# Altium schematic sheet Block Diagram.SchDoc: Block diagram
size A4; Organization: Blinkinlabs, LLC; DocumentNumber: 1; SheetNumber: 1; SheetTotal: 14
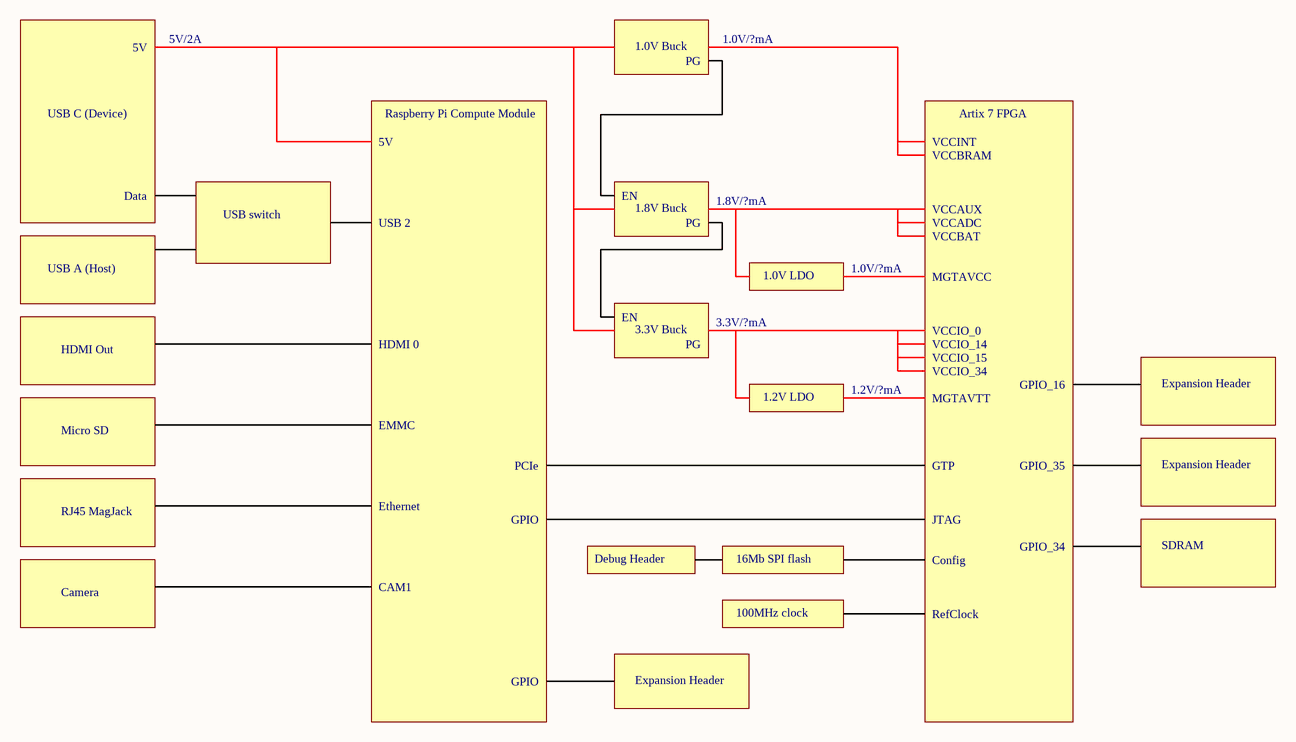
[diagram p0: Block Diagram.SchDoc]

## Notes on the sheet
- 5V
- 5V/2A
- 1.0V Buck
- PG
- 1.0V/?mA
- USB C (Device)
- Raspberry Pi Compute Module
- VCCINT
- Artix 7 FPGA
- Data
- EN
- 1.8V Buck
- 1.8V/?mA
- VCCAUX
- VCCBRAM
- USB A (Host)
- USB switch
- USB 2
- VCCADC
- VCCBAT
- MGTAVCC
- HDMI 0
- 3.3V Buck
- 3.3V/?mA
- 1.0V LDO
- VCCIO_0
- VCCIO_14
- HDMI Out
- 1.2V LDO
- 1.2V/?mA
- MGTAVTT
- VCCIO_15
- VCCIO_34
- GPIO_16
- Expansion Header
- Micro SD
- EMMC
- PCIe
- GTP
- GPIO_35
- RJ45 MagJack
- Ethernet
- GPIO
- JTAG
- GPIO_34
- Camera
- CAM1
- Debug Header
- 100MHz clock
- 16Mb SPI flash
- RefClock
- Config
- SDRAM
- Title:
- Project:
- Revision:
- Date:
- Time:
- Sheet
- of